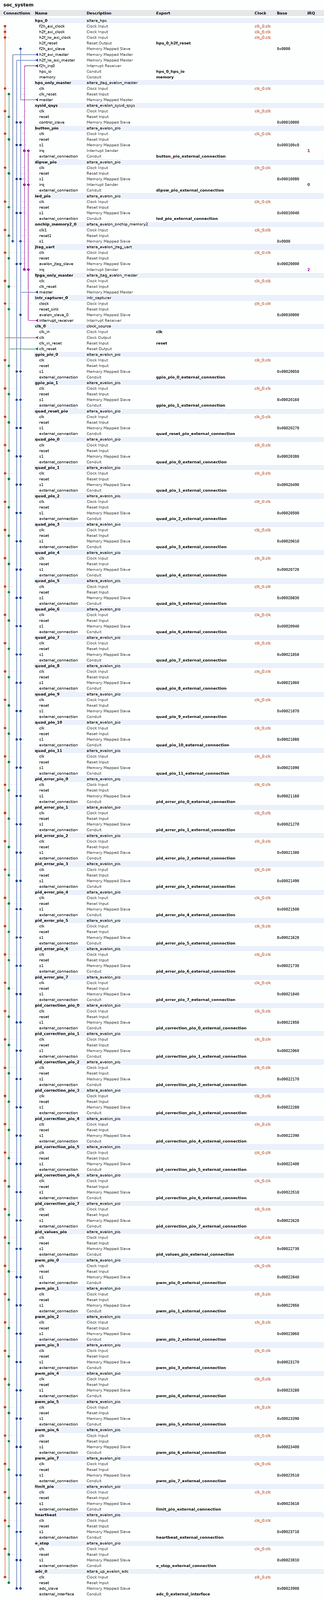
[diagram p0: system contents, whole]
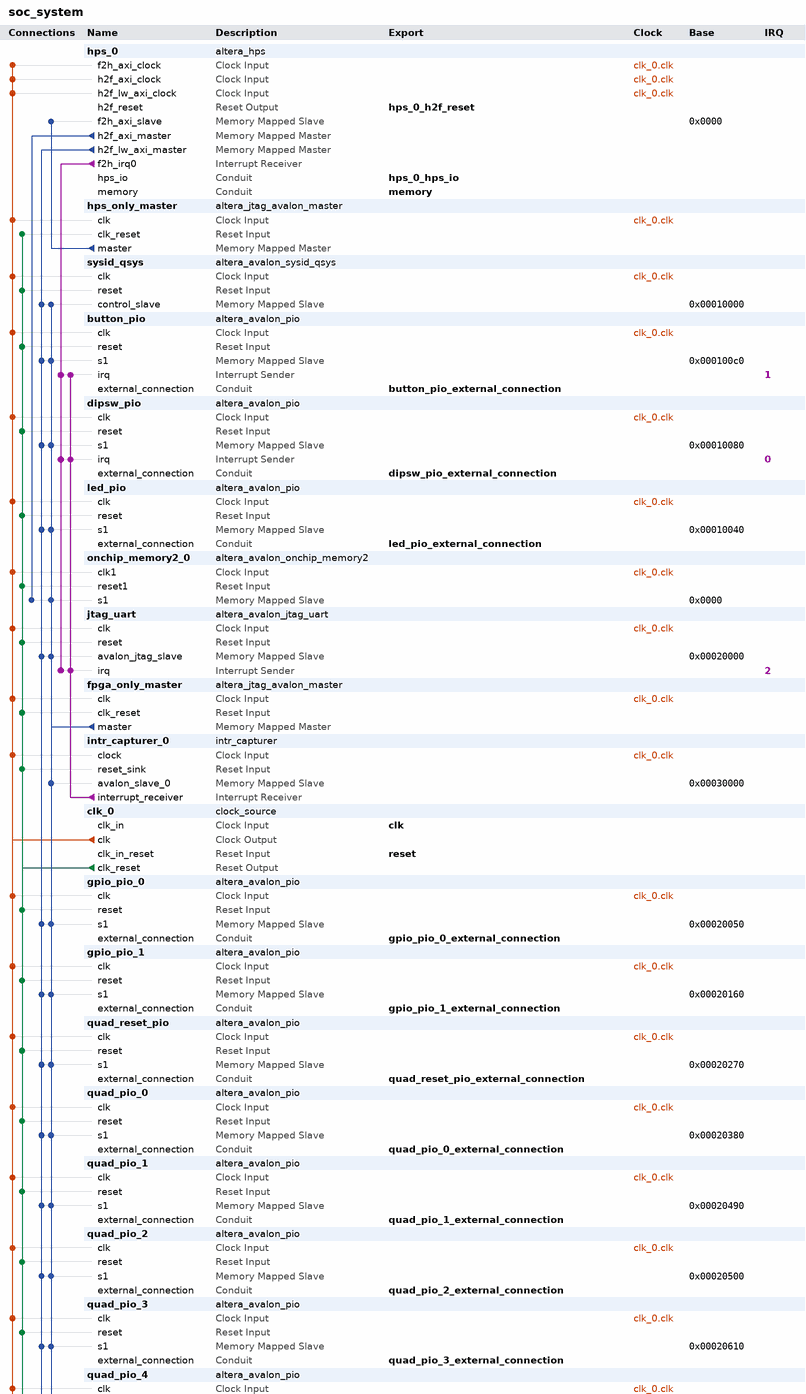
[diagram p1: system contents, upper part]
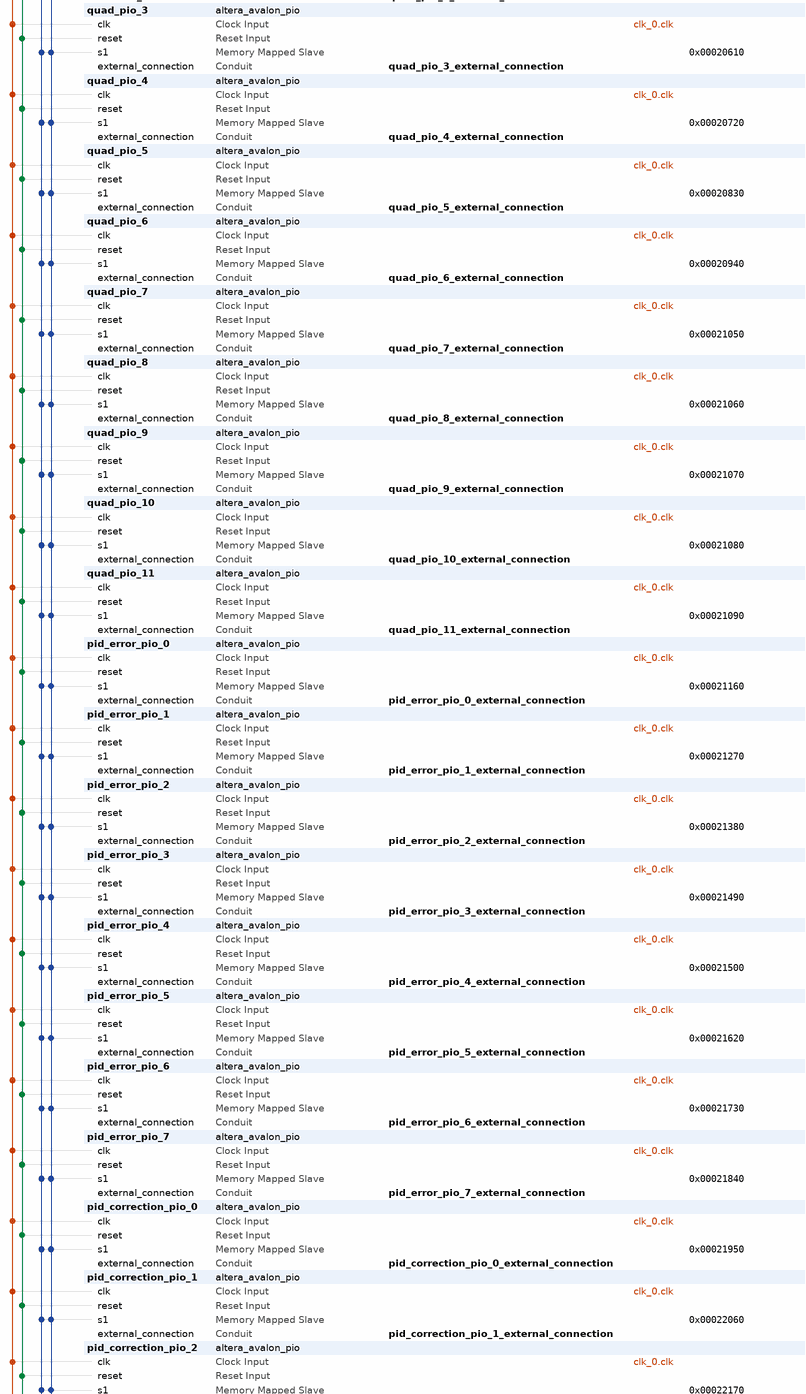
[diagram p2: system contents, middle part]
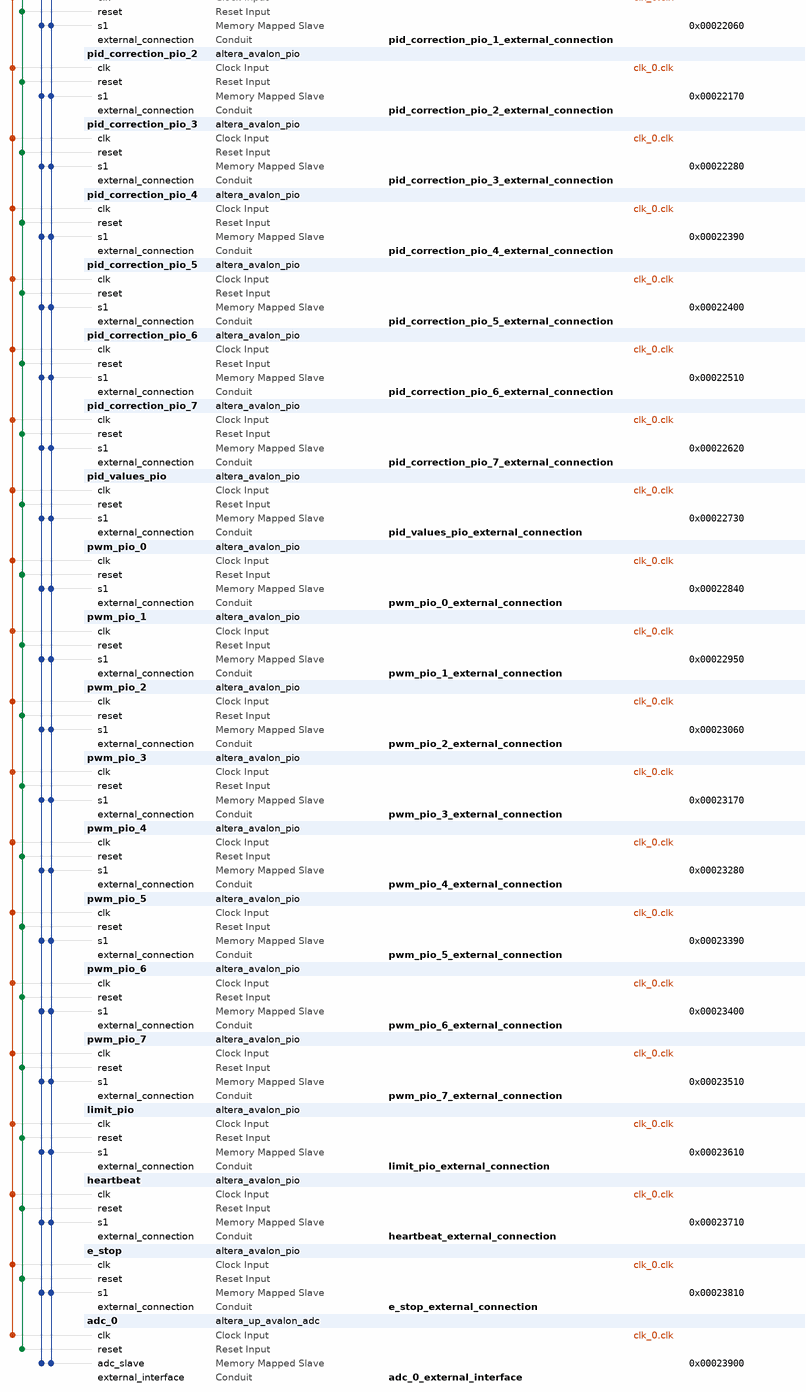
[diagram p3: system contents, lower part]
# Platform Designer (Qsys) system soc_system, Cyclone V 5CSEMA4U23C6
# Parameters at their usual value, and those the tool derives, are not listed.
package require -exact qsys 17.0
create_system soc_system
set_project_property DEVICE_FAMILY {Cyclone V}
set_project_property DEVICE 5CSEMA4U23C6

add_instance hps_0 altera_hps 17.0
set_instance_parameter_value hps_0 EMAC1_Mode RGMII
set_instance_parameter_value hps_0 EMAC1_PinMuxing {HPS I/O Set 0}
set_instance_parameter_value hps_0 F2SCLK_COLDRST_Enable false
set_instance_parameter_value hps_0 F2SCLK_DBGRST_Enable false
set_instance_parameter_value hps_0 F2SCLK_WARMRST_Enable false
set_instance_parameter_value hps_0 F2SINTERRUPT_Enable true
set_instance_parameter_value hps_0 F2S_Width 3
set_instance_parameter_value hps_0 FPGA_PERIPHERAL_OUTPUT_CLOCK_FREQ_EMAC0_GTX_CLK 100
set_instance_parameter_value hps_0 FPGA_PERIPHERAL_OUTPUT_CLOCK_FREQ_EMAC0_MD_CLK 100.0
set_instance_parameter_value hps_0 FPGA_PERIPHERAL_OUTPUT_CLOCK_FREQ_EMAC1_GTX_CLK 100
set_instance_parameter_value hps_0 FPGA_PERIPHERAL_OUTPUT_CLOCK_FREQ_EMAC1_MD_CLK 100.0
set_instance_parameter_value hps_0 HPS_PROTOCOL DDR3
set_instance_parameter_value hps_0 I2C0_Mode I2C
set_instance_parameter_value hps_0 I2C0_PinMuxing {HPS I/O Set 0}
set_instance_parameter_value hps_0 I2C1_Mode I2C
set_instance_parameter_value hps_0 I2C1_PinMuxing {HPS I/O Set 0}
set_instance_parameter_value hps_0 LWH2F_Enable true
set_instance_parameter_value hps_0 MEM_BANKADDR_WIDTH 3
set_instance_parameter_value hps_0 MEM_CLK_FREQ 400.0
set_instance_parameter_value hps_0 MEM_COL_ADDR_WIDTH 10
set_instance_parameter_value hps_0 MEM_DQ_WIDTH 32
set_instance_parameter_value hps_0 MEM_DRV_STR RZQ/6
set_instance_parameter_value hps_0 MEM_ROW_ADDR_WIDTH 15
set_instance_parameter_value hps_0 MEM_RTT_NOM RZQ/6
set_instance_parameter_value hps_0 MEM_RTT_WR {Dynamic ODT off}
set_instance_parameter_value hps_0 MEM_TCL 7
set_instance_parameter_value hps_0 MEM_TFAW_NS 37.5
set_instance_parameter_value hps_0 MEM_TRAS_NS 35.0
set_instance_parameter_value hps_0 MEM_TRCD_NS 13.75
set_instance_parameter_value hps_0 MEM_TRFC_NS 300.0
set_instance_parameter_value hps_0 MEM_TRP_NS 13.75
set_instance_parameter_value hps_0 MEM_VENDOR Other
set_instance_parameter_value hps_0 MEM_WTCL 7
set_instance_parameter_value hps_0 QSPI_Mode N/A
set_instance_parameter_value hps_0 QSPI_PinMuxing Unused
set_instance_parameter_value hps_0 REF_CLK_FREQ 25.0
set_instance_parameter_value hps_0 S2FCLK_USER2CLK 5
set_instance_parameter_value hps_0 S2F_Width 2
set_instance_parameter_value hps_0 SDIO_Mode {4-bit Data}
set_instance_parameter_value hps_0 SDIO_PinMuxing {HPS I/O Set 0}
set_instance_parameter_value hps_0 SPIM1_Mode {Single Slave Select}
set_instance_parameter_value hps_0 SPIM1_PinMuxing {HPS I/O Set 0}
set_instance_parameter_value hps_0 STM_Enable false
set_instance_parameter_value hps_0 TIMING_BOARD_AC_SKEW 0.02
set_instance_parameter_value hps_0 TIMING_BOARD_AC_TO_CK_SKEW 0.0
set_instance_parameter_value hps_0 TIMING_BOARD_DQ_TO_DQS_SKEW 0.0
set_instance_parameter_value hps_0 TIMING_BOARD_MAX_CK_DELAY 0.6
set_instance_parameter_value hps_0 TIMING_BOARD_MAX_DQS_DELAY 0.6
set_instance_parameter_value hps_0 TIMING_BOARD_SKEW_BETWEEN_DQS 0.02
set_instance_parameter_value hps_0 TIMING_BOARD_SKEW_CKDQS_DIMM_MAX 0.01
set_instance_parameter_value hps_0 TIMING_BOARD_SKEW_CKDQS_DIMM_MIN -0.01
set_instance_parameter_value hps_0 TIMING_BOARD_SKEW_WITHIN_DQS 0.02
set_instance_parameter_value hps_0 TIMING_TDH 125
set_instance_parameter_value hps_0 TIMING_TDQSCK 400
set_instance_parameter_value hps_0 TIMING_TDQSQ 120
set_instance_parameter_value hps_0 TIMING_TDS 50
set_instance_parameter_value hps_0 TIMING_TIH 250
set_instance_parameter_value hps_0 TIMING_TIS 175
set_instance_parameter_value hps_0 TIMING_TQSH 0.38
set_instance_parameter_value hps_0 UART0_Mode {No Flow Control}
set_instance_parameter_value hps_0 UART0_PinMuxing {HPS I/O Set 0}
set_instance_parameter_value hps_0 USB1_Mode SDR
set_instance_parameter_value hps_0 USB1_PinMuxing {HPS I/O Set 0}
set_instance_parameter_value hps_0 desired_cfg_clk_mhz 100.0
set_instance_parameter_value hps_0 desired_qspi_clk_mhz 370.0

add_instance hps_only_master altera_jtag_avalon_master 17.0

add_instance sysid_qsys altera_avalon_sysid_qsys 17.0
set_instance_parameter_value sysid_qsys id -1395322110

add_instance button_pio altera_avalon_pio 17.0
set_instance_parameter_value button_pio bitClearingEdgeCapReg true
set_instance_parameter_value button_pio captureEdge true
set_instance_parameter_value button_pio direction Input
set_instance_parameter_value button_pio edgeType FALLING
set_instance_parameter_value button_pio generateIRQ true
set_instance_parameter_value button_pio irqType EDGE
set_instance_parameter_value button_pio width 4

add_instance dipsw_pio altera_avalon_pio 17.0
set_instance_parameter_value dipsw_pio bitClearingEdgeCapReg true
set_instance_parameter_value dipsw_pio captureEdge true
set_instance_parameter_value dipsw_pio direction Input
set_instance_parameter_value dipsw_pio edgeType ANY
set_instance_parameter_value dipsw_pio generateIRQ true
set_instance_parameter_value dipsw_pio irqType EDGE
set_instance_parameter_value dipsw_pio width 4

add_instance led_pio altera_avalon_pio 17.0
set_instance_parameter_value led_pio direction Output
set_instance_parameter_value led_pio width 8

add_instance onchip_memory2_0 altera_avalon_onchip_memory2 17.0
set_instance_parameter_value onchip_memory2_0 dataWidth 64
set_instance_parameter_value onchip_memory2_0 dualPort false
set_instance_parameter_value onchip_memory2_0 initMemContent true
set_instance_parameter_value onchip_memory2_0 initializationFileName onchip_memory2_0
set_instance_parameter_value onchip_memory2_0 memorySize 65536

add_instance jtag_uart altera_avalon_jtag_uart 17.0
set_instance_parameter_value jtag_uart allowMultipleConnections true
set_instance_parameter_value jtag_uart simInteractiveOptions INTERACTIVE_ASCII_OUTPUT

add_instance fpga_only_master altera_jtag_avalon_master 17.0

add_instance intr_capturer_0 intr_capturer 100.99.98.97

add_instance clk_0 clock_source 17.0
set_instance_parameter_value clk_0 clockFrequency 50000000

add_instance gpio_pio_0 altera_avalon_pio 17.0
set_instance_parameter_value gpio_pio_0 direction Output
set_instance_parameter_value gpio_pio_0 width 8

add_instance gpio_pio_1 altera_avalon_pio 17.0
set_instance_parameter_value gpio_pio_1 direction Output
set_instance_parameter_value gpio_pio_1 width 8

add_instance quad_reset_pio altera_avalon_pio 17.0
set_instance_parameter_value quad_reset_pio direction Output
set_instance_parameter_value quad_reset_pio width 32

add_instance quad_pio_0 altera_avalon_pio 17.0
set_instance_parameter_value quad_pio_0 direction Input
set_instance_parameter_value quad_pio_0 width 32

add_instance quad_pio_1 altera_avalon_pio 17.0
set_instance_parameter_value quad_pio_1 direction Input
set_instance_parameter_value quad_pio_1 width 32

add_instance quad_pio_2 altera_avalon_pio 17.0
set_instance_parameter_value quad_pio_2 direction Input
set_instance_parameter_value quad_pio_2 width 32

add_instance quad_pio_3 altera_avalon_pio 17.0
set_instance_parameter_value quad_pio_3 direction Input
set_instance_parameter_value quad_pio_3 width 32

add_instance quad_pio_4 altera_avalon_pio 17.0
set_instance_parameter_value quad_pio_4 direction Input
set_instance_parameter_value quad_pio_4 width 32

add_instance quad_pio_5 altera_avalon_pio 17.0
set_instance_parameter_value quad_pio_5 direction Input
set_instance_parameter_value quad_pio_5 width 32

add_instance quad_pio_6 altera_avalon_pio 17.0
set_instance_parameter_value quad_pio_6 direction Input
set_instance_parameter_value quad_pio_6 width 32

add_instance quad_pio_7 altera_avalon_pio 17.0
set_instance_parameter_value quad_pio_7 direction Input
set_instance_parameter_value quad_pio_7 width 32

add_instance quad_pio_8 altera_avalon_pio 17.0
set_instance_parameter_value quad_pio_8 direction Input
set_instance_parameter_value quad_pio_8 width 32

add_instance quad_pio_9 altera_avalon_pio 17.0
set_instance_parameter_value quad_pio_9 direction Input
set_instance_parameter_value quad_pio_9 width 32

add_instance quad_pio_10 altera_avalon_pio 17.0
set_instance_parameter_value quad_pio_10 direction Input
set_instance_parameter_value quad_pio_10 width 32

add_instance quad_pio_11 altera_avalon_pio 17.0
set_instance_parameter_value quad_pio_11 direction Input
set_instance_parameter_value quad_pio_11 width 32

add_instance pid_error_pio_0 altera_avalon_pio 17.0
set_instance_parameter_value pid_error_pio_0 direction Output
set_instance_parameter_value pid_error_pio_0 width 32

add_instance pid_error_pio_1 altera_avalon_pio 17.0
set_instance_parameter_value pid_error_pio_1 direction Output
set_instance_parameter_value pid_error_pio_1 width 32

add_instance pid_error_pio_2 altera_avalon_pio 17.0
set_instance_parameter_value pid_error_pio_2 direction Output
set_instance_parameter_value pid_error_pio_2 width 32

add_instance pid_error_pio_3 altera_avalon_pio 17.0
set_instance_parameter_value pid_error_pio_3 direction Output
set_instance_parameter_value pid_error_pio_3 width 32

add_instance pid_error_pio_4 altera_avalon_pio 17.0
set_instance_parameter_value pid_error_pio_4 direction Output
set_instance_parameter_value pid_error_pio_4 width 32

add_instance pid_error_pio_5 altera_avalon_pio 17.0
set_instance_parameter_value pid_error_pio_5 direction Output
set_instance_parameter_value pid_error_pio_5 width 32

add_instance pid_error_pio_6 altera_avalon_pio 17.0
set_instance_parameter_value pid_error_pio_6 direction Output
set_instance_parameter_value pid_error_pio_6 width 32

add_instance pid_error_pio_7 altera_avalon_pio 17.0
set_instance_parameter_value pid_error_pio_7 direction Output
set_instance_parameter_value pid_error_pio_7 width 32

add_instance pid_correction_pio_0 altera_avalon_pio 17.0
set_instance_parameter_value pid_correction_pio_0 direction Input
set_instance_parameter_value pid_correction_pio_0 width 32

add_instance pid_correction_pio_1 altera_avalon_pio 17.0
set_instance_parameter_value pid_correction_pio_1 direction Input
set_instance_parameter_value pid_correction_pio_1 width 32

add_instance pid_correction_pio_2 altera_avalon_pio 17.0
set_instance_parameter_value pid_correction_pio_2 direction Input
set_instance_parameter_value pid_correction_pio_2 width 32

add_instance pid_correction_pio_3 altera_avalon_pio 17.0
set_instance_parameter_value pid_correction_pio_3 direction Input
set_instance_parameter_value pid_correction_pio_3 width 32

add_instance pid_correction_pio_4 altera_avalon_pio 17.0
set_instance_parameter_value pid_correction_pio_4 direction Input
set_instance_parameter_value pid_correction_pio_4 width 32

add_instance pid_correction_pio_5 altera_avalon_pio 17.0
set_instance_parameter_value pid_correction_pio_5 direction Input
set_instance_parameter_value pid_correction_pio_5 width 32

add_instance pid_correction_pio_6 altera_avalon_pio 17.0
set_instance_parameter_value pid_correction_pio_6 direction Input
set_instance_parameter_value pid_correction_pio_6 width 32

add_instance pid_correction_pio_7 altera_avalon_pio 17.0
set_instance_parameter_value pid_correction_pio_7 direction Input
set_instance_parameter_value pid_correction_pio_7 width 32

add_instance pid_values_pio altera_avalon_pio 17.0
set_instance_parameter_value pid_values_pio direction Output
set_instance_parameter_value pid_values_pio width 32

add_instance pwm_pio_0 altera_avalon_pio 17.0
set_instance_parameter_value pwm_pio_0 direction Output
set_instance_parameter_value pwm_pio_0 width 32

add_instance pwm_pio_1 altera_avalon_pio 17.0
set_instance_parameter_value pwm_pio_1 direction Output
set_instance_parameter_value pwm_pio_1 width 32

add_instance pwm_pio_2 altera_avalon_pio 17.0
set_instance_parameter_value pwm_pio_2 direction Output
set_instance_parameter_value pwm_pio_2 width 32

add_instance pwm_pio_3 altera_avalon_pio 17.0
set_instance_parameter_value pwm_pio_3 direction Output
set_instance_parameter_value pwm_pio_3 width 32

add_instance pwm_pio_4 altera_avalon_pio 17.0
set_instance_parameter_value pwm_pio_4 direction Output
set_instance_parameter_value pwm_pio_4 width 32

add_instance pwm_pio_5 altera_avalon_pio 17.0
set_instance_parameter_value pwm_pio_5 direction Output
set_instance_parameter_value pwm_pio_5 width 32

add_instance pwm_pio_6 altera_avalon_pio 17.0
set_instance_parameter_value pwm_pio_6 direction Output
set_instance_parameter_value pwm_pio_6 width 32

add_instance pwm_pio_7 altera_avalon_pio 17.0
set_instance_parameter_value pwm_pio_7 direction Output
set_instance_parameter_value pwm_pio_7 width 32

add_instance limit_pio altera_avalon_pio 17.0
set_instance_parameter_value limit_pio direction Input
set_instance_parameter_value limit_pio width 8

add_instance heartbeat altera_avalon_pio 17.0
set_instance_parameter_value heartbeat direction Output
set_instance_parameter_value heartbeat width 32

add_instance e_stop altera_avalon_pio 17.0
set_instance_parameter_value e_stop direction Input
set_instance_parameter_value e_stop width 1

add_instance adc_0 altera_up_avalon_adc 17.0
set_instance_parameter_value adc_0 board DE0-Nano-SoC
set_instance_parameter_value adc_0 numch_ 8

# connections
add_connection clk_0.clk adc_0.clk clock
add_connection clk_0.clk button_pio.clk clock
add_connection clk_0.clk dipsw_pio.clk clock
add_connection clk_0.clk e_stop.clk clock
add_connection clk_0.clk fpga_only_master.clk clock
add_connection clk_0.clk gpio_pio_0.clk clock
add_connection clk_0.clk gpio_pio_1.clk clock
add_connection clk_0.clk heartbeat.clk clock
add_connection clk_0.clk hps_0.f2h_axi_clock clock
add_connection clk_0.clk hps_0.h2f_axi_clock clock
add_connection clk_0.clk hps_0.h2f_lw_axi_clock clock
add_connection clk_0.clk hps_only_master.clk clock
add_connection clk_0.clk intr_capturer_0.clock clock
add_connection clk_0.clk jtag_uart.clk clock
add_connection clk_0.clk led_pio.clk clock
add_connection clk_0.clk limit_pio.clk clock
add_connection clk_0.clk onchip_memory2_0.clk1 clock
add_connection clk_0.clk pid_correction_pio_0.clk clock
add_connection clk_0.clk pid_correction_pio_1.clk clock
add_connection clk_0.clk pid_correction_pio_2.clk clock
add_connection clk_0.clk pid_correction_pio_3.clk clock
add_connection clk_0.clk pid_correction_pio_4.clk clock
add_connection clk_0.clk pid_correction_pio_5.clk clock
add_connection clk_0.clk pid_correction_pio_6.clk clock
add_connection clk_0.clk pid_correction_pio_7.clk clock
add_connection clk_0.clk pid_error_pio_0.clk clock
add_connection clk_0.clk pid_error_pio_1.clk clock
add_connection clk_0.clk pid_error_pio_2.clk clock
add_connection clk_0.clk pid_error_pio_3.clk clock
add_connection clk_0.clk pid_error_pio_4.clk clock
add_connection clk_0.clk pid_error_pio_5.clk clock
add_connection clk_0.clk pid_error_pio_6.clk clock
add_connection clk_0.clk pid_error_pio_7.clk clock
add_connection clk_0.clk pid_values_pio.clk clock
add_connection clk_0.clk pwm_pio_0.clk clock
add_connection clk_0.clk pwm_pio_1.clk clock
add_connection clk_0.clk pwm_pio_2.clk clock
add_connection clk_0.clk pwm_pio_3.clk clock
add_connection clk_0.clk pwm_pio_4.clk clock
add_connection clk_0.clk pwm_pio_5.clk clock
add_connection clk_0.clk pwm_pio_6.clk clock
add_connection clk_0.clk pwm_pio_7.clk clock
add_connection clk_0.clk quad_pio_0.clk clock
add_connection clk_0.clk quad_pio_1.clk clock
add_connection clk_0.clk quad_pio_2.clk clock
add_connection clk_0.clk quad_pio_3.clk clock
add_connection clk_0.clk quad_pio_4.clk clock
add_connection clk_0.clk quad_pio_5.clk clock
add_connection clk_0.clk quad_pio_6.clk clock
add_connection clk_0.clk quad_pio_7.clk clock
add_connection clk_0.clk quad_pio_8.clk clock
add_connection clk_0.clk quad_pio_9.clk clock
add_connection clk_0.clk quad_pio_10.clk clock
add_connection clk_0.clk quad_pio_11.clk clock
add_connection clk_0.clk quad_reset_pio.clk clock
add_connection clk_0.clk sysid_qsys.clk clock
add_connection clk_0.clk_reset adc_0.reset reset
add_connection clk_0.clk_reset button_pio.reset reset
add_connection clk_0.clk_reset dipsw_pio.reset reset
add_connection clk_0.clk_reset e_stop.reset reset
add_connection clk_0.clk_reset fpga_only_master.clk_reset reset
add_connection clk_0.clk_reset gpio_pio_0.reset reset
add_connection clk_0.clk_reset gpio_pio_1.reset reset
add_connection clk_0.clk_reset heartbeat.reset reset
add_connection clk_0.clk_reset hps_only_master.clk_reset reset
add_connection clk_0.clk_reset intr_capturer_0.reset_sink reset
add_connection clk_0.clk_reset jtag_uart.reset reset
add_connection clk_0.clk_reset led_pio.reset reset
add_connection clk_0.clk_reset limit_pio.reset reset
add_connection clk_0.clk_reset onchip_memory2_0.reset1 reset
add_connection clk_0.clk_reset pid_correction_pio_0.reset reset
add_connection clk_0.clk_reset pid_correction_pio_1.reset reset
add_connection clk_0.clk_reset pid_correction_pio_2.reset reset
add_connection clk_0.clk_reset pid_correction_pio_3.reset reset
add_connection clk_0.clk_reset pid_correction_pio_4.reset reset
add_connection clk_0.clk_reset pid_correction_pio_5.reset reset
add_connection clk_0.clk_reset pid_correction_pio_6.reset reset
add_connection clk_0.clk_reset pid_correction_pio_7.reset reset
add_connection clk_0.clk_reset pid_error_pio_0.reset reset
add_connection clk_0.clk_reset pid_error_pio_1.reset reset
add_connection clk_0.clk_reset pid_error_pio_2.reset reset
add_connection clk_0.clk_reset pid_error_pio_3.reset reset
add_connection clk_0.clk_reset pid_error_pio_4.reset reset
add_connection clk_0.clk_reset pid_error_pio_5.reset reset
add_connection clk_0.clk_reset pid_error_pio_6.reset reset
add_connection clk_0.clk_reset pid_error_pio_7.reset reset
add_connection clk_0.clk_reset pid_values_pio.reset reset
add_connection clk_0.clk_reset pwm_pio_0.reset reset
add_connection clk_0.clk_reset pwm_pio_1.reset reset
add_connection clk_0.clk_reset pwm_pio_2.reset reset
add_connection clk_0.clk_reset pwm_pio_3.reset reset
add_connection clk_0.clk_reset pwm_pio_4.reset reset
add_connection clk_0.clk_reset pwm_pio_5.reset reset
add_connection clk_0.clk_reset pwm_pio_6.reset reset
add_connection clk_0.clk_reset pwm_pio_7.reset reset
add_connection clk_0.clk_reset quad_pio_0.reset reset
add_connection clk_0.clk_reset quad_pio_1.reset reset
add_connection clk_0.clk_reset quad_pio_2.reset reset
add_connection clk_0.clk_reset quad_pio_3.reset reset
add_connection clk_0.clk_reset quad_pio_4.reset reset
add_connection clk_0.clk_reset quad_pio_5.reset reset
add_connection clk_0.clk_reset quad_pio_6.reset reset
add_connection clk_0.clk_reset quad_pio_7.reset reset
add_connection clk_0.clk_reset quad_pio_8.reset reset
add_connection clk_0.clk_reset quad_pio_9.reset reset
add_connection clk_0.clk_reset quad_pio_10.reset reset
add_connection clk_0.clk_reset quad_pio_11.reset reset
add_connection clk_0.clk_reset quad_reset_pio.reset reset
add_connection clk_0.clk_reset sysid_qsys.reset reset
add_connection fpga_only_master.master adc_0.adc_slave avalon
set_connection_parameter_value fpga_only_master.master/adc_0.adc_slave baseAddress 0x00023900
add_connection fpga_only_master.master button_pio.s1 avalon
set_connection_parameter_value fpga_only_master.master/button_pio.s1 baseAddress 0x000100c0
add_connection fpga_only_master.master dipsw_pio.s1 avalon
set_connection_parameter_value fpga_only_master.master/dipsw_pio.s1 baseAddress 0x00010080
add_connection fpga_only_master.master e_stop.s1 avalon
set_connection_parameter_value fpga_only_master.master/e_stop.s1 baseAddress 0x00023810
add_connection fpga_only_master.master gpio_pio_0.s1 avalon
set_connection_parameter_value fpga_only_master.master/gpio_pio_0.s1 baseAddress 0x00020050
add_connection fpga_only_master.master gpio_pio_1.s1 avalon
set_connection_parameter_value fpga_only_master.master/gpio_pio_1.s1 baseAddress 0x00020160
add_connection fpga_only_master.master heartbeat.s1 avalon
set_connection_parameter_value fpga_only_master.master/heartbeat.s1 baseAddress 0x00023710
add_connection fpga_only_master.master intr_capturer_0.avalon_slave_0 avalon
set_connection_parameter_value fpga_only_master.master/intr_capturer_0.avalon_slave_0 baseAddress 0x00030000
add_connection fpga_only_master.master jtag_uart.avalon_jtag_slave avalon
set_connection_parameter_value fpga_only_master.master/jtag_uart.avalon_jtag_slave baseAddress 0x00020000
add_connection fpga_only_master.master led_pio.s1 avalon
set_connection_parameter_value fpga_only_master.master/led_pio.s1 baseAddress 0x00010040
add_connection fpga_only_master.master limit_pio.s1 avalon
set_connection_parameter_value fpga_only_master.master/limit_pio.s1 baseAddress 0x00023610
add_connection fpga_only_master.master onchip_memory2_0.s1 avalon
set_connection_parameter_value fpga_only_master.master/onchip_memory2_0.s1 baseAddress 0x0000
add_connection fpga_only_master.master pid_correction_pio_0.s1 avalon
set_connection_parameter_value fpga_only_master.master/pid_correction_pio_0.s1 baseAddress 0x00021950
add_connection fpga_only_master.master pid_correction_pio_1.s1 avalon
set_connection_parameter_value fpga_only_master.master/pid_correction_pio_1.s1 baseAddress 0x00022060
add_connection fpga_only_master.master pid_correction_pio_2.s1 avalon
set_connection_parameter_value fpga_only_master.master/pid_correction_pio_2.s1 baseAddress 0x00022170
add_connection fpga_only_master.master pid_correction_pio_3.s1 avalon
set_connection_parameter_value fpga_only_master.master/pid_correction_pio_3.s1 baseAddress 0x00022280
add_connection fpga_only_master.master pid_correction_pio_4.s1 avalon
set_connection_parameter_value fpga_only_master.master/pid_correction_pio_4.s1 baseAddress 0x00022390
add_connection fpga_only_master.master pid_correction_pio_5.s1 avalon
set_connection_parameter_value fpga_only_master.master/pid_correction_pio_5.s1 baseAddress 0x00022400
add_connection fpga_only_master.master pid_correction_pio_6.s1 avalon
set_connection_parameter_value fpga_only_master.master/pid_correction_pio_6.s1 baseAddress 0x00022510
add_connection fpga_only_master.master pid_correction_pio_7.s1 avalon
set_connection_parameter_value fpga_only_master.master/pid_correction_pio_7.s1 baseAddress 0x00022620
add_connection fpga_only_master.master pid_error_pio_0.s1 avalon
set_connection_parameter_value fpga_only_master.master/pid_error_pio_0.s1 baseAddress 0x00021160
add_connection fpga_only_master.master pid_error_pio_1.s1 avalon
set_connection_parameter_value fpga_only_master.master/pid_error_pio_1.s1 baseAddress 0x00021270
add_connection fpga_only_master.master pid_error_pio_2.s1 avalon
set_connection_parameter_value fpga_only_master.master/pid_error_pio_2.s1 baseAddress 0x00021380
add_connection fpga_only_master.master pid_error_pio_3.s1 avalon
set_connection_parameter_value fpga_only_master.master/pid_error_pio_3.s1 baseAddress 0x00021490
add_connection fpga_only_master.master pid_error_pio_4.s1 avalon
set_connection_parameter_value fpga_only_master.master/pid_error_pio_4.s1 baseAddress 0x00021500
add_connection fpga_only_master.master pid_error_pio_5.s1 avalon
set_connection_parameter_value fpga_only_master.master/pid_error_pio_5.s1 baseAddress 0x00021620
add_connection fpga_only_master.master pid_error_pio_6.s1 avalon
set_connection_parameter_value fpga_only_master.master/pid_error_pio_6.s1 baseAddress 0x00021730
add_connection fpga_only_master.master pid_error_pio_7.s1 avalon
set_connection_parameter_value fpga_only_master.master/pid_error_pio_7.s1 baseAddress 0x00021840
add_connection fpga_only_master.master pid_values_pio.s1 avalon
set_connection_parameter_value fpga_only_master.master/pid_values_pio.s1 baseAddress 0x00022730
add_connection fpga_only_master.master pwm_pio_0.s1 avalon
set_connection_parameter_value fpga_only_master.master/pwm_pio_0.s1 baseAddress 0x00022840
add_connection fpga_only_master.master pwm_pio_1.s1 avalon
set_connection_parameter_value fpga_only_master.master/pwm_pio_1.s1 baseAddress 0x00022950
add_connection fpga_only_master.master pwm_pio_2.s1 avalon
set_connection_parameter_value fpga_only_master.master/pwm_pio_2.s1 baseAddress 0x00023060
add_connection fpga_only_master.master pwm_pio_3.s1 avalon
set_connection_parameter_value fpga_only_master.master/pwm_pio_3.s1 baseAddress 0x00023170
add_connection fpga_only_master.master pwm_pio_4.s1 avalon
set_connection_parameter_value fpga_only_master.master/pwm_pio_4.s1 baseAddress 0x00023280
add_connection fpga_only_master.master pwm_pio_5.s1 avalon
set_connection_parameter_value fpga_only_master.master/pwm_pio_5.s1 baseAddress 0x00023390
add_connection fpga_only_master.master pwm_pio_6.s1 avalon
set_connection_parameter_value fpga_only_master.master/pwm_pio_6.s1 baseAddress 0x00023400
add_connection fpga_only_master.master pwm_pio_7.s1 avalon
set_connection_parameter_value fpga_only_master.master/pwm_pio_7.s1 baseAddress 0x00023510
add_connection fpga_only_master.master quad_pio_0.s1 avalon
set_connection_parameter_value fpga_only_master.master/quad_pio_0.s1 baseAddress 0x00020380
add_connection fpga_only_master.master quad_pio_1.s1 avalon
set_connection_parameter_value fpga_only_master.master/quad_pio_1.s1 baseAddress 0x00020490
add_connection fpga_only_master.master quad_pio_2.s1 avalon
set_connection_parameter_value fpga_only_master.master/quad_pio_2.s1 baseAddress 0x00020500
add_connection fpga_only_master.master quad_pio_3.s1 avalon
set_connection_parameter_value fpga_only_master.master/quad_pio_3.s1 baseAddress 0x00020610
add_connection fpga_only_master.master quad_pio_4.s1 avalon
set_connection_parameter_value fpga_only_master.master/quad_pio_4.s1 baseAddress 0x00020720
add_connection fpga_only_master.master quad_pio_5.s1 avalon
set_connection_parameter_value fpga_only_master.master/quad_pio_5.s1 baseAddress 0x00020830
add_connection fpga_only_master.master quad_pio_6.s1 avalon
set_connection_parameter_value fpga_only_master.master/quad_pio_6.s1 baseAddress 0x00020940
add_connection fpga_only_master.master quad_pio_7.s1 avalon
set_connection_parameter_value fpga_only_master.master/quad_pio_7.s1 baseAddress 0x00021050
add_connection fpga_only_master.master quad_pio_8.s1 avalon
set_connection_parameter_value fpga_only_master.master/quad_pio_8.s1 baseAddress 0x00021060
add_connection fpga_only_master.master quad_pio_9.s1 avalon
set_connection_parameter_value fpga_only_master.master/quad_pio_9.s1 baseAddress 0x00021070
add_connection fpga_only_master.master quad_pio_10.s1 avalon
set_connection_parameter_value fpga_only_master.master/quad_pio_10.s1 baseAddress 0x00021080
add_connection fpga_only_master.master quad_pio_11.s1 avalon
set_connection_parameter_value fpga_only_master.master/quad_pio_11.s1 baseAddress 0x00021090
add_connection fpga_only_master.master quad_reset_pio.s1 avalon
set_connection_parameter_value fpga_only_master.master/quad_reset_pio.s1 baseAddress 0x00020270
add_connection fpga_only_master.master sysid_qsys.control_slave avalon
set_connection_parameter_value fpga_only_master.master/sysid_qsys.control_slave baseAddress 0x00010000
add_connection hps_0.h2f_axi_master onchip_memory2_0.s1 avalon
set_connection_parameter_value hps_0.h2f_axi_master/onchip_memory2_0.s1 baseAddress 0x0000
add_connection hps_0.h2f_lw_axi_master adc_0.adc_slave avalon
set_connection_parameter_value hps_0.h2f_lw_axi_master/adc_0.adc_slave baseAddress 0x00023900
add_connection hps_0.h2f_lw_axi_master button_pio.s1 avalon
set_connection_parameter_value hps_0.h2f_lw_axi_master/button_pio.s1 baseAddress 0x000100c0
add_connection hps_0.h2f_lw_axi_master dipsw_pio.s1 avalon
set_connection_parameter_value hps_0.h2f_lw_axi_master/dipsw_pio.s1 baseAddress 0x00010080
add_connection hps_0.h2f_lw_axi_master e_stop.s1 avalon
set_connection_parameter_value hps_0.h2f_lw_axi_master/e_stop.s1 baseAddress 0x00023810
add_connection hps_0.h2f_lw_axi_master gpio_pio_0.s1 avalon
set_connection_parameter_value hps_0.h2f_lw_axi_master/gpio_pio_0.s1 baseAddress 0x00020050
add_connection hps_0.h2f_lw_axi_master gpio_pio_1.s1 avalon
set_connection_parameter_value hps_0.h2f_lw_axi_master/gpio_pio_1.s1 baseAddress 0x00020160
add_connection hps_0.h2f_lw_axi_master heartbeat.s1 avalon
set_connection_parameter_value hps_0.h2f_lw_axi_master/heartbeat.s1 baseAddress 0x00023710
add_connection hps_0.h2f_lw_axi_master jtag_uart.avalon_jtag_slave avalon
set_connection_parameter_value hps_0.h2f_lw_axi_master/jtag_uart.avalon_jtag_slave baseAddress 0x00020000
add_connection hps_0.h2f_lw_axi_master led_pio.s1 avalon
set_connection_parameter_value hps_0.h2f_lw_axi_master/led_pio.s1 baseAddress 0x00010040
add_connection hps_0.h2f_lw_axi_master limit_pio.s1 avalon
set_connection_parameter_value hps_0.h2f_lw_axi_master/limit_pio.s1 baseAddress 0x00023610
add_connection hps_0.h2f_lw_axi_master pid_correction_pio_0.s1 avalon
set_connection_parameter_value hps_0.h2f_lw_axi_master/pid_correction_pio_0.s1 baseAddress 0x00021950
add_connection hps_0.h2f_lw_axi_master pid_correction_pio_1.s1 avalon
set_connection_parameter_value hps_0.h2f_lw_axi_master/pid_correction_pio_1.s1 baseAddress 0x00022060
add_connection hps_0.h2f_lw_axi_master pid_correction_pio_2.s1 avalon
set_connection_parameter_value hps_0.h2f_lw_axi_master/pid_correction_pio_2.s1 baseAddress 0x00022170
add_connection hps_0.h2f_lw_axi_master pid_correction_pio_3.s1 avalon
set_connection_parameter_value hps_0.h2f_lw_axi_master/pid_correction_pio_3.s1 baseAddress 0x00022280
add_connection hps_0.h2f_lw_axi_master pid_correction_pio_4.s1 avalon
set_connection_parameter_value hps_0.h2f_lw_axi_master/pid_correction_pio_4.s1 baseAddress 0x00022390
add_connection hps_0.h2f_lw_axi_master pid_correction_pio_5.s1 avalon
set_connection_parameter_value hps_0.h2f_lw_axi_master/pid_correction_pio_5.s1 baseAddress 0x00022400
add_connection hps_0.h2f_lw_axi_master pid_correction_pio_6.s1 avalon
set_connection_parameter_value hps_0.h2f_lw_axi_master/pid_correction_pio_6.s1 baseAddress 0x00022510
add_connection hps_0.h2f_lw_axi_master pid_correction_pio_7.s1 avalon
set_connection_parameter_value hps_0.h2f_lw_axi_master/pid_correction_pio_7.s1 baseAddress 0x00022620
add_connection hps_0.h2f_lw_axi_master pid_error_pio_0.s1 avalon
set_connection_parameter_value hps_0.h2f_lw_axi_master/pid_error_pio_0.s1 baseAddress 0x00021160
add_connection hps_0.h2f_lw_axi_master pid_error_pio_1.s1 avalon
set_connection_parameter_value hps_0.h2f_lw_axi_master/pid_error_pio_1.s1 baseAddress 0x00021270
add_connection hps_0.h2f_lw_axi_master pid_error_pio_2.s1 avalon
set_connection_parameter_value hps_0.h2f_lw_axi_master/pid_error_pio_2.s1 baseAddress 0x00021380
add_connection hps_0.h2f_lw_axi_master pid_error_pio_3.s1 avalon
set_connection_parameter_value hps_0.h2f_lw_axi_master/pid_error_pio_3.s1 baseAddress 0x00021490
add_connection hps_0.h2f_lw_axi_master pid_error_pio_4.s1 avalon
set_connection_parameter_value hps_0.h2f_lw_axi_master/pid_error_pio_4.s1 baseAddress 0x00021500
add_connection hps_0.h2f_lw_axi_master pid_error_pio_5.s1 avalon
set_connection_parameter_value hps_0.h2f_lw_axi_master/pid_error_pio_5.s1 baseAddress 0x00021620
add_connection hps_0.h2f_lw_axi_master pid_error_pio_6.s1 avalon
set_connection_parameter_value hps_0.h2f_lw_axi_master/pid_error_pio_6.s1 baseAddress 0x00021730
add_connection hps_0.h2f_lw_axi_master pid_error_pio_7.s1 avalon
set_connection_parameter_value hps_0.h2f_lw_axi_master/pid_error_pio_7.s1 baseAddress 0x00021840
add_connection hps_0.h2f_lw_axi_master pid_values_pio.s1 avalon
set_connection_parameter_value hps_0.h2f_lw_axi_master/pid_values_pio.s1 baseAddress 0x00022730
add_connection hps_0.h2f_lw_axi_master pwm_pio_0.s1 avalon
set_connection_parameter_value hps_0.h2f_lw_axi_master/pwm_pio_0.s1 baseAddress 0x00022840
add_connection hps_0.h2f_lw_axi_master pwm_pio_1.s1 avalon
set_connection_parameter_value hps_0.h2f_lw_axi_master/pwm_pio_1.s1 baseAddress 0x00022950
add_connection hps_0.h2f_lw_axi_master pwm_pio_2.s1 avalon
set_connection_parameter_value hps_0.h2f_lw_axi_master/pwm_pio_2.s1 baseAddress 0x00023060
add_connection hps_0.h2f_lw_axi_master pwm_pio_3.s1 avalon
set_connection_parameter_value hps_0.h2f_lw_axi_master/pwm_pio_3.s1 baseAddress 0x00023170
add_connection hps_0.h2f_lw_axi_master pwm_pio_4.s1 avalon
set_connection_parameter_value hps_0.h2f_lw_axi_master/pwm_pio_4.s1 baseAddress 0x00023280
add_connection hps_0.h2f_lw_axi_master pwm_pio_5.s1 avalon
set_connection_parameter_value hps_0.h2f_lw_axi_master/pwm_pio_5.s1 baseAddress 0x00023390
add_connection hps_0.h2f_lw_axi_master pwm_pio_6.s1 avalon
set_connection_parameter_value hps_0.h2f_lw_axi_master/pwm_pio_6.s1 baseAddress 0x00023400
add_connection hps_0.h2f_lw_axi_master pwm_pio_7.s1 avalon
set_connection_parameter_value hps_0.h2f_lw_axi_master/pwm_pio_7.s1 baseAddress 0x00023510
add_connection hps_0.h2f_lw_axi_master quad_pio_0.s1 avalon
set_connection_parameter_value hps_0.h2f_lw_axi_master/quad_pio_0.s1 baseAddress 0x00020380
add_connection hps_0.h2f_lw_axi_master quad_pio_1.s1 avalon
set_connection_parameter_value hps_0.h2f_lw_axi_master/quad_pio_1.s1 baseAddress 0x00020490
add_connection hps_0.h2f_lw_axi_master quad_pio_2.s1 avalon
set_connection_parameter_value hps_0.h2f_lw_axi_master/quad_pio_2.s1 baseAddress 0x00020500
add_connection hps_0.h2f_lw_axi_master quad_pio_3.s1 avalon
set_connection_parameter_value hps_0.h2f_lw_axi_master/quad_pio_3.s1 baseAddress 0x00020610
add_connection hps_0.h2f_lw_axi_master quad_pio_4.s1 avalon
set_connection_parameter_value hps_0.h2f_lw_axi_master/quad_pio_4.s1 baseAddress 0x00020720
add_connection hps_0.h2f_lw_axi_master quad_pio_5.s1 avalon
set_connection_parameter_value hps_0.h2f_lw_axi_master/quad_pio_5.s1 baseAddress 0x00020830
add_connection hps_0.h2f_lw_axi_master quad_pio_6.s1 avalon
set_connection_parameter_value hps_0.h2f_lw_axi_master/quad_pio_6.s1 baseAddress 0x00020940
add_connection hps_0.h2f_lw_axi_master quad_pio_7.s1 avalon
set_connection_parameter_value hps_0.h2f_lw_axi_master/quad_pio_7.s1 baseAddress 0x00021050
add_connection hps_0.h2f_lw_axi_master quad_pio_8.s1 avalon
set_connection_parameter_value hps_0.h2f_lw_axi_master/quad_pio_8.s1 baseAddress 0x00021060
add_connection hps_0.h2f_lw_axi_master quad_pio_9.s1 avalon
set_connection_parameter_value hps_0.h2f_lw_axi_master/quad_pio_9.s1 baseAddress 0x00021070
add_connection hps_0.h2f_lw_axi_master quad_pio_10.s1 avalon
set_connection_parameter_value hps_0.h2f_lw_axi_master/quad_pio_10.s1 baseAddress 0x00021080
add_connection hps_0.h2f_lw_axi_master quad_pio_11.s1 avalon
set_connection_parameter_value hps_0.h2f_lw_axi_master/quad_pio_11.s1 baseAddress 0x00021090
add_connection hps_0.h2f_lw_axi_master quad_reset_pio.s1 avalon
set_connection_parameter_value hps_0.h2f_lw_axi_master/quad_reset_pio.s1 baseAddress 0x00020270
add_connection hps_0.h2f_lw_axi_master sysid_qsys.control_slave avalon
set_connection_parameter_value hps_0.h2f_lw_axi_master/sysid_qsys.control_slave baseAddress 0x00010000
add_connection hps_only_master.master hps_0.f2h_axi_slave avalon
set_connection_parameter_value hps_only_master.master/hps_0.f2h_axi_slave baseAddress 0x0000
add_connection hps_0.f2h_irq0 button_pio.irq interrupt
set_connection_parameter_value hps_0.f2h_irq0/button_pio.irq irqNumber 1
add_connection hps_0.f2h_irq0 dipsw_pio.irq interrupt
set_connection_parameter_value hps_0.f2h_irq0/dipsw_pio.irq irqNumber 0
add_connection hps_0.f2h_irq0 jtag_uart.irq interrupt
set_connection_parameter_value hps_0.f2h_irq0/jtag_uart.irq irqNumber 2
add_connection intr_capturer_0.interrupt_receiver button_pio.irq interrupt
set_connection_parameter_value intr_capturer_0.interrupt_receiver/button_pio.irq irqNumber 1
add_connection intr_capturer_0.interrupt_receiver dipsw_pio.irq interrupt
set_connection_parameter_value intr_capturer_0.interrupt_receiver/dipsw_pio.irq irqNumber 0
add_connection intr_capturer_0.interrupt_receiver jtag_uart.irq interrupt
set_connection_parameter_value intr_capturer_0.interrupt_receiver/jtag_uart.irq irqNumber 2

# exported interfaces
add_interface adc_0_external_interface conduit end
set_interface_property adc_0_external_interface EXPORT_OF adc_0.external_interface
add_interface button_pio_external_connection conduit end
set_interface_property button_pio_external_connection EXPORT_OF button_pio.external_connection
add_interface clk clock sink
set_interface_property clk EXPORT_OF clk_0.clk_in
add_interface dipsw_pio_external_connection conduit end
set_interface_property dipsw_pio_external_connection EXPORT_OF dipsw_pio.external_connection
add_interface e_stop_external_connection conduit end
set_interface_property e_stop_external_connection EXPORT_OF e_stop.external_connection
add_interface gpio_pio_0_external_connection conduit end
set_interface_property gpio_pio_0_external_connection EXPORT_OF gpio_pio_0.external_connection
add_interface gpio_pio_1_external_connection conduit end
set_interface_property gpio_pio_1_external_connection EXPORT_OF gpio_pio_1.external_connection
add_interface heartbeat_external_connection conduit end
set_interface_property heartbeat_external_connection EXPORT_OF heartbeat.external_connection
add_interface hps_0_h2f_reset reset source
set_interface_property hps_0_h2f_reset EXPORT_OF hps_0.h2f_reset
add_interface hps_0_hps_io conduit end
set_interface_property hps_0_hps_io EXPORT_OF hps_0.hps_io
add_interface led_pio_external_connection conduit end
set_interface_property led_pio_external_connection EXPORT_OF led_pio.external_connection
add_interface limit_pio_external_connection conduit end
set_interface_property limit_pio_external_connection EXPORT_OF limit_pio.external_connection
add_interface memory conduit end
set_interface_property memory EXPORT_OF hps_0.memory
add_interface pid_correction_pio_0_external_connection conduit end
set_interface_property pid_correction_pio_0_external_connection EXPORT_OF pid_correction_pio_0.external_connection
add_interface pid_correction_pio_1_external_connection conduit end
set_interface_property pid_correction_pio_1_external_connection EXPORT_OF pid_correction_pio_1.external_connection
add_interface pid_correction_pio_2_external_connection conduit end
set_interface_property pid_correction_pio_2_external_connection EXPORT_OF pid_correction_pio_2.external_connection
add_interface pid_correction_pio_3_external_connection conduit end
set_interface_property pid_correction_pio_3_external_connection EXPORT_OF pid_correction_pio_3.external_connection
add_interface pid_correction_pio_4_external_connection conduit end
set_interface_property pid_correction_pio_4_external_connection EXPORT_OF pid_correction_pio_4.external_connection
add_interface pid_correction_pio_5_external_connection conduit end
set_interface_property pid_correction_pio_5_external_connection EXPORT_OF pid_correction_pio_5.external_connection
add_interface pid_correction_pio_6_external_connection conduit end
set_interface_property pid_correction_pio_6_external_connection EXPORT_OF pid_correction_pio_6.external_connection
add_interface pid_correction_pio_7_external_connection conduit end
set_interface_property pid_correction_pio_7_external_connection EXPORT_OF pid_correction_pio_7.external_connection
add_interface pid_error_pio_0_external_connection conduit end
set_interface_property pid_error_pio_0_external_connection EXPORT_OF pid_error_pio_0.external_connection
add_interface pid_error_pio_1_external_connection conduit end
set_interface_property pid_error_pio_1_external_connection EXPORT_OF pid_error_pio_1.external_connection
add_interface pid_error_pio_2_external_connection conduit end
set_interface_property pid_error_pio_2_external_connection EXPORT_OF pid_error_pio_2.external_connection
add_interface pid_error_pio_3_external_connection conduit end
set_interface_property pid_error_pio_3_external_connection EXPORT_OF pid_error_pio_3.external_connection
add_interface pid_error_pio_4_external_connection conduit end
set_interface_property pid_error_pio_4_external_connection EXPORT_OF pid_error_pio_4.external_connection
add_interface pid_error_pio_5_external_connection conduit end
set_interface_property pid_error_pio_5_external_connection EXPORT_OF pid_error_pio_5.external_connection
add_interface pid_error_pio_6_external_connection conduit end
set_interface_property pid_error_pio_6_external_connection EXPORT_OF pid_error_pio_6.external_connection
add_interface pid_error_pio_7_external_connection conduit end
set_interface_property pid_error_pio_7_external_connection EXPORT_OF pid_error_pio_7.external_connection
add_interface pid_values_pio_external_connection conduit end
set_interface_property pid_values_pio_external_connection EXPORT_OF pid_values_pio.external_connection
add_interface pwm_pio_0_external_connection conduit end
set_interface_property pwm_pio_0_external_connection EXPORT_OF pwm_pio_0.external_connection
add_interface pwm_pio_1_external_connection conduit end
set_interface_property pwm_pio_1_external_connection EXPORT_OF pwm_pio_1.external_connection
add_interface pwm_pio_2_external_connection conduit end
set_interface_property pwm_pio_2_external_connection EXPORT_OF pwm_pio_2.external_connection
add_interface pwm_pio_3_external_connection conduit end
set_interface_property pwm_pio_3_external_connection EXPORT_OF pwm_pio_3.external_connection
add_interface pwm_pio_4_external_connection conduit end
set_interface_property pwm_pio_4_external_connection EXPORT_OF pwm_pio_4.external_connection
add_interface pwm_pio_5_external_connection conduit end
set_interface_property pwm_pio_5_external_connection EXPORT_OF pwm_pio_5.external_connection
add_interface pwm_pio_6_external_connection conduit end
set_interface_property pwm_pio_6_external_connection EXPORT_OF pwm_pio_6.external_connection
add_interface pwm_pio_7_external_connection conduit end
set_interface_property pwm_pio_7_external_connection EXPORT_OF pwm_pio_7.external_connection
add_interface quad_pio_0_external_connection conduit end
set_interface_property quad_pio_0_external_connection EXPORT_OF quad_pio_0.external_connection
add_interface quad_pio_10_external_connection conduit end
set_interface_property quad_pio_10_external_connection EXPORT_OF quad_pio_10.external_connection
add_interface quad_pio_11_external_connection conduit end
set_interface_property quad_pio_11_external_connection EXPORT_OF quad_pio_11.external_connection
add_interface quad_pio_1_external_connection conduit end
set_interface_property quad_pio_1_external_connection EXPORT_OF quad_pio_1.external_connection
add_interface quad_pio_2_external_connection conduit end
set_interface_property quad_pio_2_external_connection EXPORT_OF quad_pio_2.external_connection
add_interface quad_pio_3_external_connection conduit end
set_interface_property quad_pio_3_external_connection EXPORT_OF quad_pio_3.external_connection
add_interface quad_pio_4_external_connection conduit end
set_interface_property quad_pio_4_external_connection EXPORT_OF quad_pio_4.external_connection
add_interface quad_pio_5_external_connection conduit end
set_interface_property quad_pio_5_external_connection EXPORT_OF quad_pio_5.external_connection
add_interface quad_pio_6_external_connection conduit end
set_interface_property quad_pio_6_external_connection EXPORT_OF quad_pio_6.external_connection
add_interface quad_pio_7_external_connection conduit end
set_interface_property quad_pio_7_external_connection EXPORT_OF quad_pio_7.external_connection
add_interface quad_pio_8_external_connection conduit end
set_interface_property quad_pio_8_external_connection EXPORT_OF quad_pio_8.external_connection
add_interface quad_pio_9_external_connection conduit end
set_interface_property quad_pio_9_external_connection EXPORT_OF quad_pio_9.external_connection
add_interface quad_reset_pio_external_connection conduit end
set_interface_property quad_reset_pio_external_connection EXPORT_OF quad_reset_pio.external_connection
add_interface reset reset sink
set_interface_property reset EXPORT_OF clk_0.clk_in_reset

set_interconnect_requirement {$system} qsys_mm.clockCrossingAdapter HANDSHAKE
set_interconnect_requirement {$system} qsys_mm.maxAdditionalLatency 1

save_system soc_system.qsys
